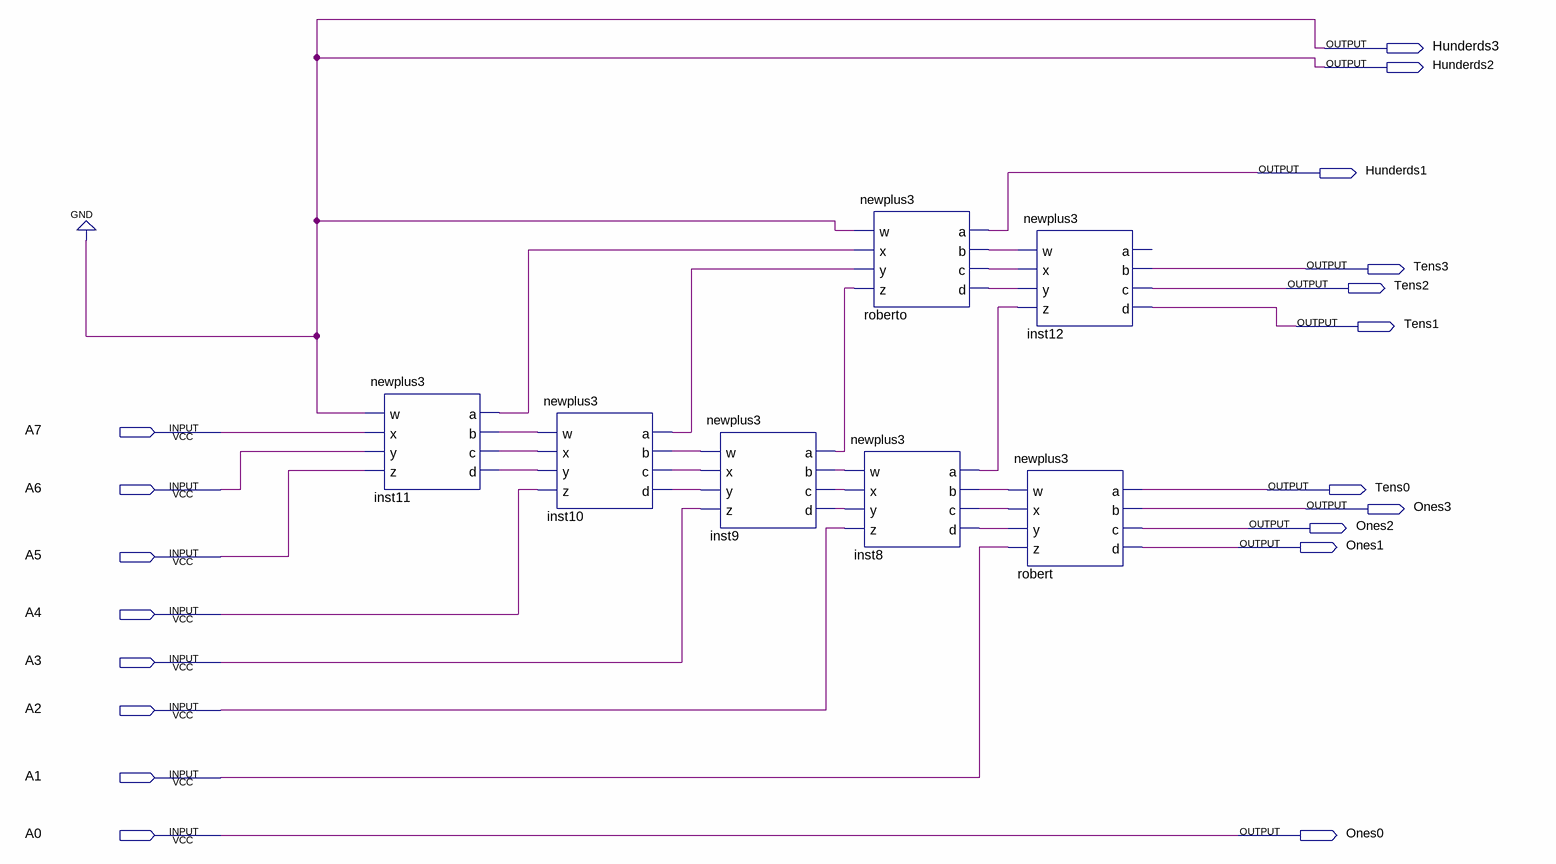
[diagram p0: schematic sheet]
// Quartus schematic FinalProject.bdf as structural Verilog: 7 symbols, 19 pins
module FinalProject (
  input  A7,
  input  A6,
  input  A5,
  input  A4,
  input  A3,
  input  A2,
  input  A1,
  input  A0,
  output Hunderds3,
  output Hunderds2,
  output Hunderds1,
  output Tens3,
  output Tens2,
  output Tens1,
  output Tens0,
  output Ones3,
  output Ones2,
  output Ones1,
  output Ones0
);

  wire inst8_a, inst8_b, inst8_c, inst8_d, inst9_a, inst9_b, inst9_c, inst9_d, inst10_a, inst10_b, inst10_c,
       inst10_d, inst11_a, inst11_b, inst11_c, inst11_d, roberto_b, roberto_c, roberto_d;

  newplus3 inst11 (.w(1'b0), .x(A7), .y(A6), .z(A5), .a(inst11_a), .b(inst11_b), .c(inst11_c), .d(inst11_d));
  newplus3 inst10 (
    .w(inst11_b), .x(inst11_c), .y(inst11_d), .z(A4), .a(inst10_a), .b(inst10_b), .c(inst10_c), .d(inst10_d));
  newplus3 inst9 (.w(inst10_b), .x(inst10_c), .y(inst10_d), .z(A3), .a(inst9_a), .b(inst9_b), .c(inst9_c), .d(inst9_d));
  newplus3 roberto (
    .w(1'b0), .x(inst11_a), .y(inst10_a), .z(inst9_a), .a(Hunderds1), .b(roberto_b), .c(roberto_c),
    .d(roberto_d));
  newplus3 inst8 (.w(inst9_b), .x(inst9_c), .y(inst9_d), .z(A2), .a(inst8_a), .b(inst8_b), .c(inst8_c), .d(inst8_d));
  newplus3 inst12 (
    .w(roberto_b), .x(roberto_c), .y(roberto_d), .z(inst8_a), .b(Tens3), .c(Tens2), .d(Tens1));  // open: a
  newplus3 robert (.w(inst8_b), .x(inst8_c), .y(inst8_d), .z(A1), .a(Tens0), .b(Ones3), .c(Ones2), .d(Ones1));

  assign Hunderds2 = 1'b0;
  assign Hunderds3 = 1'b0;
  assign Ones0 = A0;
endmodule
